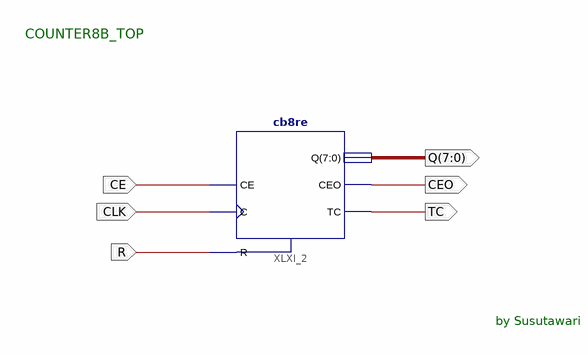
[diagram p0: schematic sheet 1]
// Xilinx ISE schematic COUNTER8B_TOP.sch (spartan3e) as structural Verilog: 1 symbols, 6 ports
module COUNTER8B_TOP (
  input  CE,
  input  CLK,
  input  R,
  output TC,
  output CEO,
  output [7:0] Q
);

  cb8re XLXI_2 (.C(CLK), .CE(CE), .R(R), .CEO(CEO), .Q(Q), .TC(TC));

  // Notes on the sheet:
  //   COUNTER8B_TOP
  //   by Susutawari
endmodule
